# EAGLE design Main Board Smart Door (EAGLE 9.6.2)
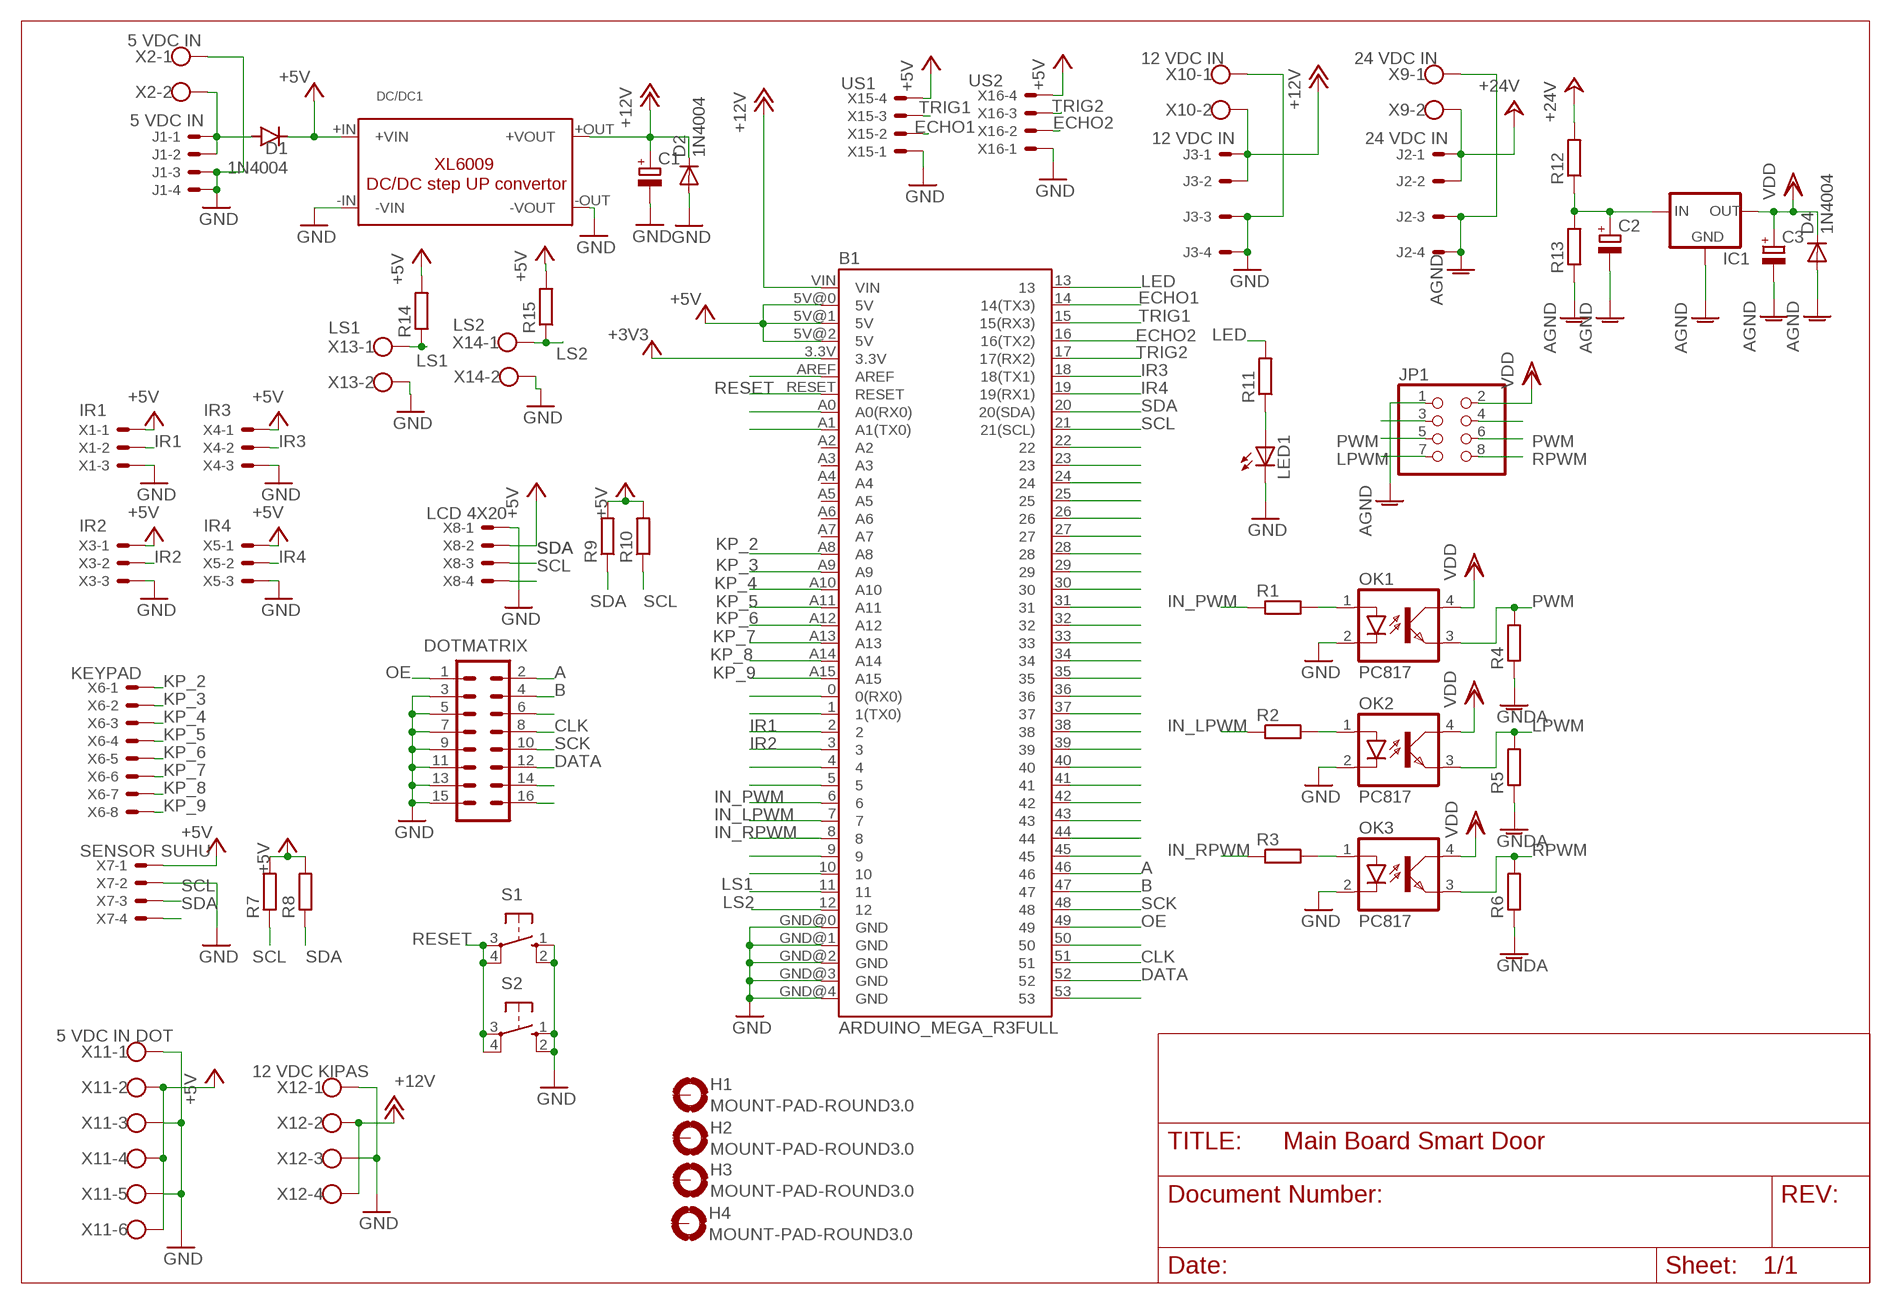
[diagram p0: schematic, sheet 1]

## Parts
B1  ARDUINO_MEGA_R3FULL  [ARDUINO_MEGA]
C1  C-POL_RADIAL-25MM-DIA  [CAPPRD550W110D1250H2500B]
C2  C-POL_RADIAL-25MM-DIA  [CAPPRD550W110D1250H2500B]
C3  C-POL_RADIAL-25MM-DIA  [CAPPRD550W110D1250H2500B]
D1  1N4004  [DO41-10]
D2  1N4004  [DO41-10]
D4  1N4004  [DO41-10]
DC/DC1  DC/DC-STEP-UP-XL6009  [DC/DC-STEP-UP-XL6009]
DOTMATRIX  ML16  [ML16]
H1  MOUNT-PAD-ROUND3.0  [3,0-PAD]
H2  MOUNT-PAD-ROUND3.0  [3,0-PAD]
H3  MOUNT-PAD-ROUND3.0  [3,0-PAD]
H4  MOUNT-PAD-ROUND3.0  [3,0-PAD]
IC1  78XXL  [78XXL]
J1  5 VDC IN  22-27-2041-04  [6410-04]
J2  24 VDC IN  22-27-2041-04  [6410-04]
J3  12 VDC IN  22-27-2041-04  [6410-04]
JP1  PINHD-2X4  [2X04]
LED1  LED5MM  [LED5MM]
OK1  PC817  [DIL04]
OK2  PC817  [DIL04]
OK3  PC817  [DIL04]
R1  R-EU_0207/10  [0207/10]
R2  R-EU_0207/10  [0207/10]
R3  R-EU_0207/10  [0207/10]
R4  R-EU_0207/10  [0207/10]
R5  R-EU_0207/10  [0207/10]
R6  R-EU_0207/10  [0207/10]
R7  R-EU_0207/10  [0207/10]
R8  R-EU_0207/10  [0207/10]
R9  R-EU_0207/10  [0207/10]
R10  R-EU_0207/10  [0207/10]
R11  R-EU_0207/10  [0207/10]
R12  R-EU_0207/10  [0207/10]
R13  R-EU_0207/10  [0207/10]
R14  R-EU_0207/10  [0207/10]
R15  R-EU_0207/10  [0207/10]
S1  40-XX  [B3F-40XX]
S2  10-XX  [B3F-10XX]
X1  IR1  JST-XH-03-PIN-LONG-PAD  [JST-XH-03-PACKAGE-LONG-PAD]
X2  5 VDC IN  W237-102  [W237-102]
X3  IR2  JST-XH-03-PIN-LONG-PAD  [JST-XH-03-PACKAGE-LONG-PAD]
X4  IR3  JST-XH-03-PIN-LONG-PAD  [JST-XH-03-PACKAGE-LONG-PAD]
X5  IR4  JST-XH-03-PIN-LONG-PAD  [JST-XH-03-PACKAGE-LONG-PAD]
X6  KEYPAD  JST-XH-08-PIN-LONG-PAD  [JST-XH-08-PACKAGE-LONG-PAD]
X7  SENSOR SUHU  JST-XH-04-PIN-LONG-PAD  [JST-XH-04-PACKAGE-LONG-PAD]
X8  LCD 4X20  JST-XH-04-PIN-LONG-PAD  [JST-XH-04-PACKAGE-LONG-PAD]
X9  24 VDC IN  W237-102  [W237-102]
X10  12 VDC IN  W237-102  [W237-102]
X11  5 VDC IN DOT  W237-6  [W237-6]
X12  12 VDC KIPAS  W237-4  [W237-4]
X13  LS1  W237-102  [W237-102]
X14  LS2  W237-102  [W237-102]
X15  US1  JST-XH-04-PIN-LONG-PAD  [JST-XH-04-PACKAGE-LONG-PAD]
X16  US2  JST-XH-04-PIN-LONG-PAD  [JST-XH-04-PACKAGE-LONG-PAD]

## Nets
+3V3: B1.3.3V
+5V: B1.5V@0(5V) B1.5V@1(5V) B1.5V@2(5V) D1.C DC/DC1.+IN(+VIN) R7.2 R8.2 R9.2 R10.2 R14.2 R15.2 X1.1 X3.1 X4.1 X5.1 X7.1 X8.2 X11.2 X11.4 X11.6 X15.4 X16.4
+12V: B1.VIN C1.1(+) D2.C DC/DC1.+OUT(+VOUT) J3.1 J3.2 X10.2 X12.2 X12.4
+24V: J2.1 J2.2 R12.2 X9.2
A: B1.46 DOTMATRIX.2
AGND: C2.2(-) C3.2(-) D4.A IC1.GND J2.3 J2.4 JP1.1 R13.1 X9.1
B: B1.47 DOTMATRIX.4
CLK: B1.51 DOTMATRIX.8
DATA: B1.52 DOTMATRIX.12
ECHO1: B1.14(14(TX3)) X15.2
ECHO2: B1.16(16(TX2)) X16.2
GND: B1.GND@0(GND) B1.GND@1(GND) B1.GND@2(GND) B1.GND@3(GND) B1.GND@4(GND) C1.2(-) D2.A DC/DC1.-IN(-VIN) DC/DC1.-OUT(-VOUT) DOTMATRIX.3 DOTMATRIX.5 DOTMATRIX.7 DOTMATRIX.9 DOTMATRIX.11 DOTMATRIX.13 DOTMATRIX.15 J1.3 J1.4 J3.3 J3.4 LED1.K(C) OK1.2(C) OK2.2(C) OK3.2(C) S1.1(S) S1.2(S1) S2.1(S) S2.2(S1) X1.3 X2.1 X3.3 X4.3 X5.3 X7.2 X8.1 X10.1 X11.1 X11.3 X11.5 X12.1 X12.3 X13.2 X14.2 X15.1 X16.1
GNDA: R4.1 R5.1 R6.1
IN_LPWM: B1.7 R2.1
IN_PWM: B1.6 R1.1
IN_RPWM: B1.8 R3.1
IR1: B1.2 X1.2
IR2: B1.3 X3.2
IR3: B1.18(18(TX1)) X4.2
IR4: B1.19(19(RX1)) X5.2
KP_2: B1.A8 X6.1
KP_3: B1.A9 X6.2
KP_4: B1.A10 X6.3
KP_5: B1.A11 X6.4
KP_6: B1.A12 X6.5
KP_7: B1.A13 X6.6
KP_8: B1.A14 X6.7
KP_9: B1.A15 X6.8
LED: B1.13 R11.2
LPWM: JP1.7 OK2.3(EMIT) R5.2
LS1: B1.11 R14.1 X13.1
LS2: B1.12 R15.1 X14.1
N$1: LED1.A R11.1
N$4: B1.AREF
N$5: D1.A J1.1 J1.2 X2.2
N$6: B1.A0(A0(RX0))
N$7: B1.A1(A1(TX0))
N$8: OK1.1(A) R1.2
N$10: JP1.3
N$12: OK2.1(A) R2.2
N$22: B1.0(0(RX0))
N$23: B1.1(1(TX0))
N$24: OK3.1(A) R3.2
N$26: B1.4
N$27: B1.5
N$31: B1.9
N$32: B1.10
N$34: JP1.4
N$43: B1.22
N$44: B1.23
N$45: B1.24
N$46: B1.25
N$47: B1.26
N$48: B1.27
N$49: B1.28
N$50: B1.29
N$51: B1.30
N$52: B1.31
N$53: B1.32
N$54: B1.33
N$55: B1.34
N$56: B1.35
N$57: B1.36
N$58: B1.37
N$59: B1.38
N$60: B1.39
N$61: B1.40
N$62: B1.41
N$63: B1.42
N$64: B1.43
N$65: B1.44
N$66: B1.45
N$71: B1.50
N$74: B1.53
N$83: DOTMATRIX.6
N$87: DOTMATRIX.14
N$88: DOTMATRIX.16
OE: B1.49 DOTMATRIX.1
PWM: JP1.5 JP1.6 OK1.3(EMIT) R4.2
RESET: B1.RESET S1.3(P) S1.4(P1) S2.3(P) S2.4(P1)
RPWM: JP1.8 OK3.3(EMIT) R6.2
SCK: B1.48 DOTMATRIX.10
SCL: B1.21(21(SCL)) R7.1 R10.1 X7.3 X8.4
SDA: B1.20(20(SDA)) R8.1 R9.1 X7.4 X8.3
TRIG1: B1.15(15(RX3)) X15.3
TRIG2: B1.17(17(RX2)) X16.3
VD1: C2.1(+) IC1.IN R12.1 R13.2
VDD: C3.1(+) D4.C IC1.OUT JP1.2 OK1.4(COL) OK2.4(COL) OK3.4(COL)
Unconnected: B1.A2 B1.A3 B1.A4 B1.A5 B1.A6 B1.A7 H1.B3,0(MOUNT) H2.B3,0(MOUNT) H3.B3,0(MOUNT) H4.B3,0(MOUNT)

## Library data of the parts
B1 = SparkFun-Boards:ARDUINO_MEGA_R3: Arduino Mega R3 ATmega2560 R3 compatible footprint. SparkFun Products: Arduino Mega 2560 R3 <https://www.sparkfun.com/products/11061>
C1-C3 = Capacitor:C-POL: Capacitor Polarised - Generic; CATEGORY: Capacitor
D1 = diode:1N4004: DIODE
D2 D4 = adafruit:1N4004: DIODE
DC/DC1 = hacesoft:DC/DC-STEP-UP-XL6009
DOTMATRIX = con-harting-ml:ML16: HARTING; OC_FARNELL: unknown; OC_NEWARK: unknown
H1-H4 = holes:MOUNT-PAD-ROUND: MOUNTING PAD, round
IC1 = v-reg-2:78XXL: VOLTAGE REGULATOR
J1-J3 = con-molex:22-?-04: CONNECTOR wire to board 2.54 mm (.1 inch) pitch header; MF: MOLEX; OC_FARNELL: unknown; OC_NEWARK: unknown
JP1 = pinhead:PINHD-2X4: PIN HEADER
LED1 = adafruit:LED: LED OSRAM: - CHIPLED LG R971, LG N971, LY N971, LG Q971, LY Q971, LO R971, LY R971 LH N974, LH R974 LS Q976, LO Q976, LY Q976 LO Q996 - Hyper CHIPLED LW Q18S LB Q993, LB Q99A, LB R99A - SideLED LS A670, LO A670, LY A670, LG A670, LP A670 LB A673, LV A673, LT A673, LW A673 LH A674 LY A675 LS A676, LA A676, LO A676, LY A676, LW A676 LS A679, LY A679, LG A679 - Hyper Micro SIDELED® LS Y876, LA Y876, LO Y876, LY Y876 LT Y87S - SmartLED LW L88C, LW L88S LB L89C, LB L89S, LG L890 LS L89K, LO L89K, LY L89K LS L896, LA L896, LO L896, LY L896 - TOPLED LS T670, LO T670, LY T670, LG T670, LP T670 LSG T670, LSP T670, LSY T670, LOP T670, LYG T670 LG T671, LOG T671, LSG T671 LB T673, LV T673, LT T673, LW T673 LH T674 LS T676, LA T676, LO T676, LY T676, LB T676, LH T676, LSB T676, LW T676 LB T67C, LV T67C, LT T67C, LS T67K, LO T67K, LY T67K, LW E67C LS E67B, LA E67B, LO E67B, LY E67B, LB E67C, LV E67C, LT E67C LW T67C LS T679, LY T679, LG T679 LS T770, LO T770, LY T770, LG T770, LP T770 LB T773, LV T773, LT T773, LW T773 LH T774 LS E675, LA E675, LY E675, LS T675 LS T776, LA T776, LO T776, LY T776, LB T776 LHGB T686 LT T68C, LB T68C - Hyper Mini TOPLED® LB M676 - Mini TOPLED Santana® LG M470 LS M47K, LO M47K, LY M47K Source: http://www.osram.convergy.de/
OK1-OK3 = optocoupler:PC817: SHARP OPTO COUPLER; MPN: PC817X4J000F; OC_FARNELL: 9707727; OC_NEWARK: 97K7059
R1-R15 = resistor:R-EU_: RESISTOR, European symbol
S1 = switch-omron:40-XX: OMRON SWITCH; MF: OMRON COMPONENTS USA; MPN: B3F-4000; OC_FARNELL: 176434; OC_NEWARK: 36K3105
S2 = switch-omron:10-XX: OMRON SWITCH; MPN: B3F-1000; OC_FARNELL: 176432; OC_NEWARK: 36M3542
X1 X3-X5 = Rembrandt Electronics - JST XH Connectors v1-0:JST-XH-03-PIN: JST XH Connector 2 Pin Wire to board connector. Pitch: 2,54 mm, (0.100") Number of pins: 3 Created by Rembrandt Electronics www.rembrandtelectronics.com
X2 X9 X10 X13 X14 = con-wago-500:W237-102: WAGO SCREW CLAMP; MPN: 237-102; OC_FARNELL: unknown; OC_NEWARK: 70K9898
X6 = Rembrandt Electronics - JST XH Connectors v1-0:JST-XH-08-PIN: JST XH Connector 2 Pin Wire to board connector. Pitch: 2,54 mm, (0.100") Number of pins: 8 Created by Rembrandt Electronics www.rembrandtelectronics.com
X7 X8 X15 X16 = Rembrandt Electronics - JST XH Connectors v1-0:JST-XH-04-PIN: JST XH Connector 2 Pin Wire to board connector. Pitch: 2,54 mm, (0.100") Number of pins: 4 Created by Rembrandt Electronics www.rembrandtelectronics.com
X11 = con-wago-500:W237-6: WAGO SCREW CLAMP; OC_FARNELL: unknown; OC_NEWARK: unknown
X12 = con-wago-500:W237-4: WAGO SCREW CLAMP; OC_FARNELL: unknown; OC_NEWARK: unknown

## Board
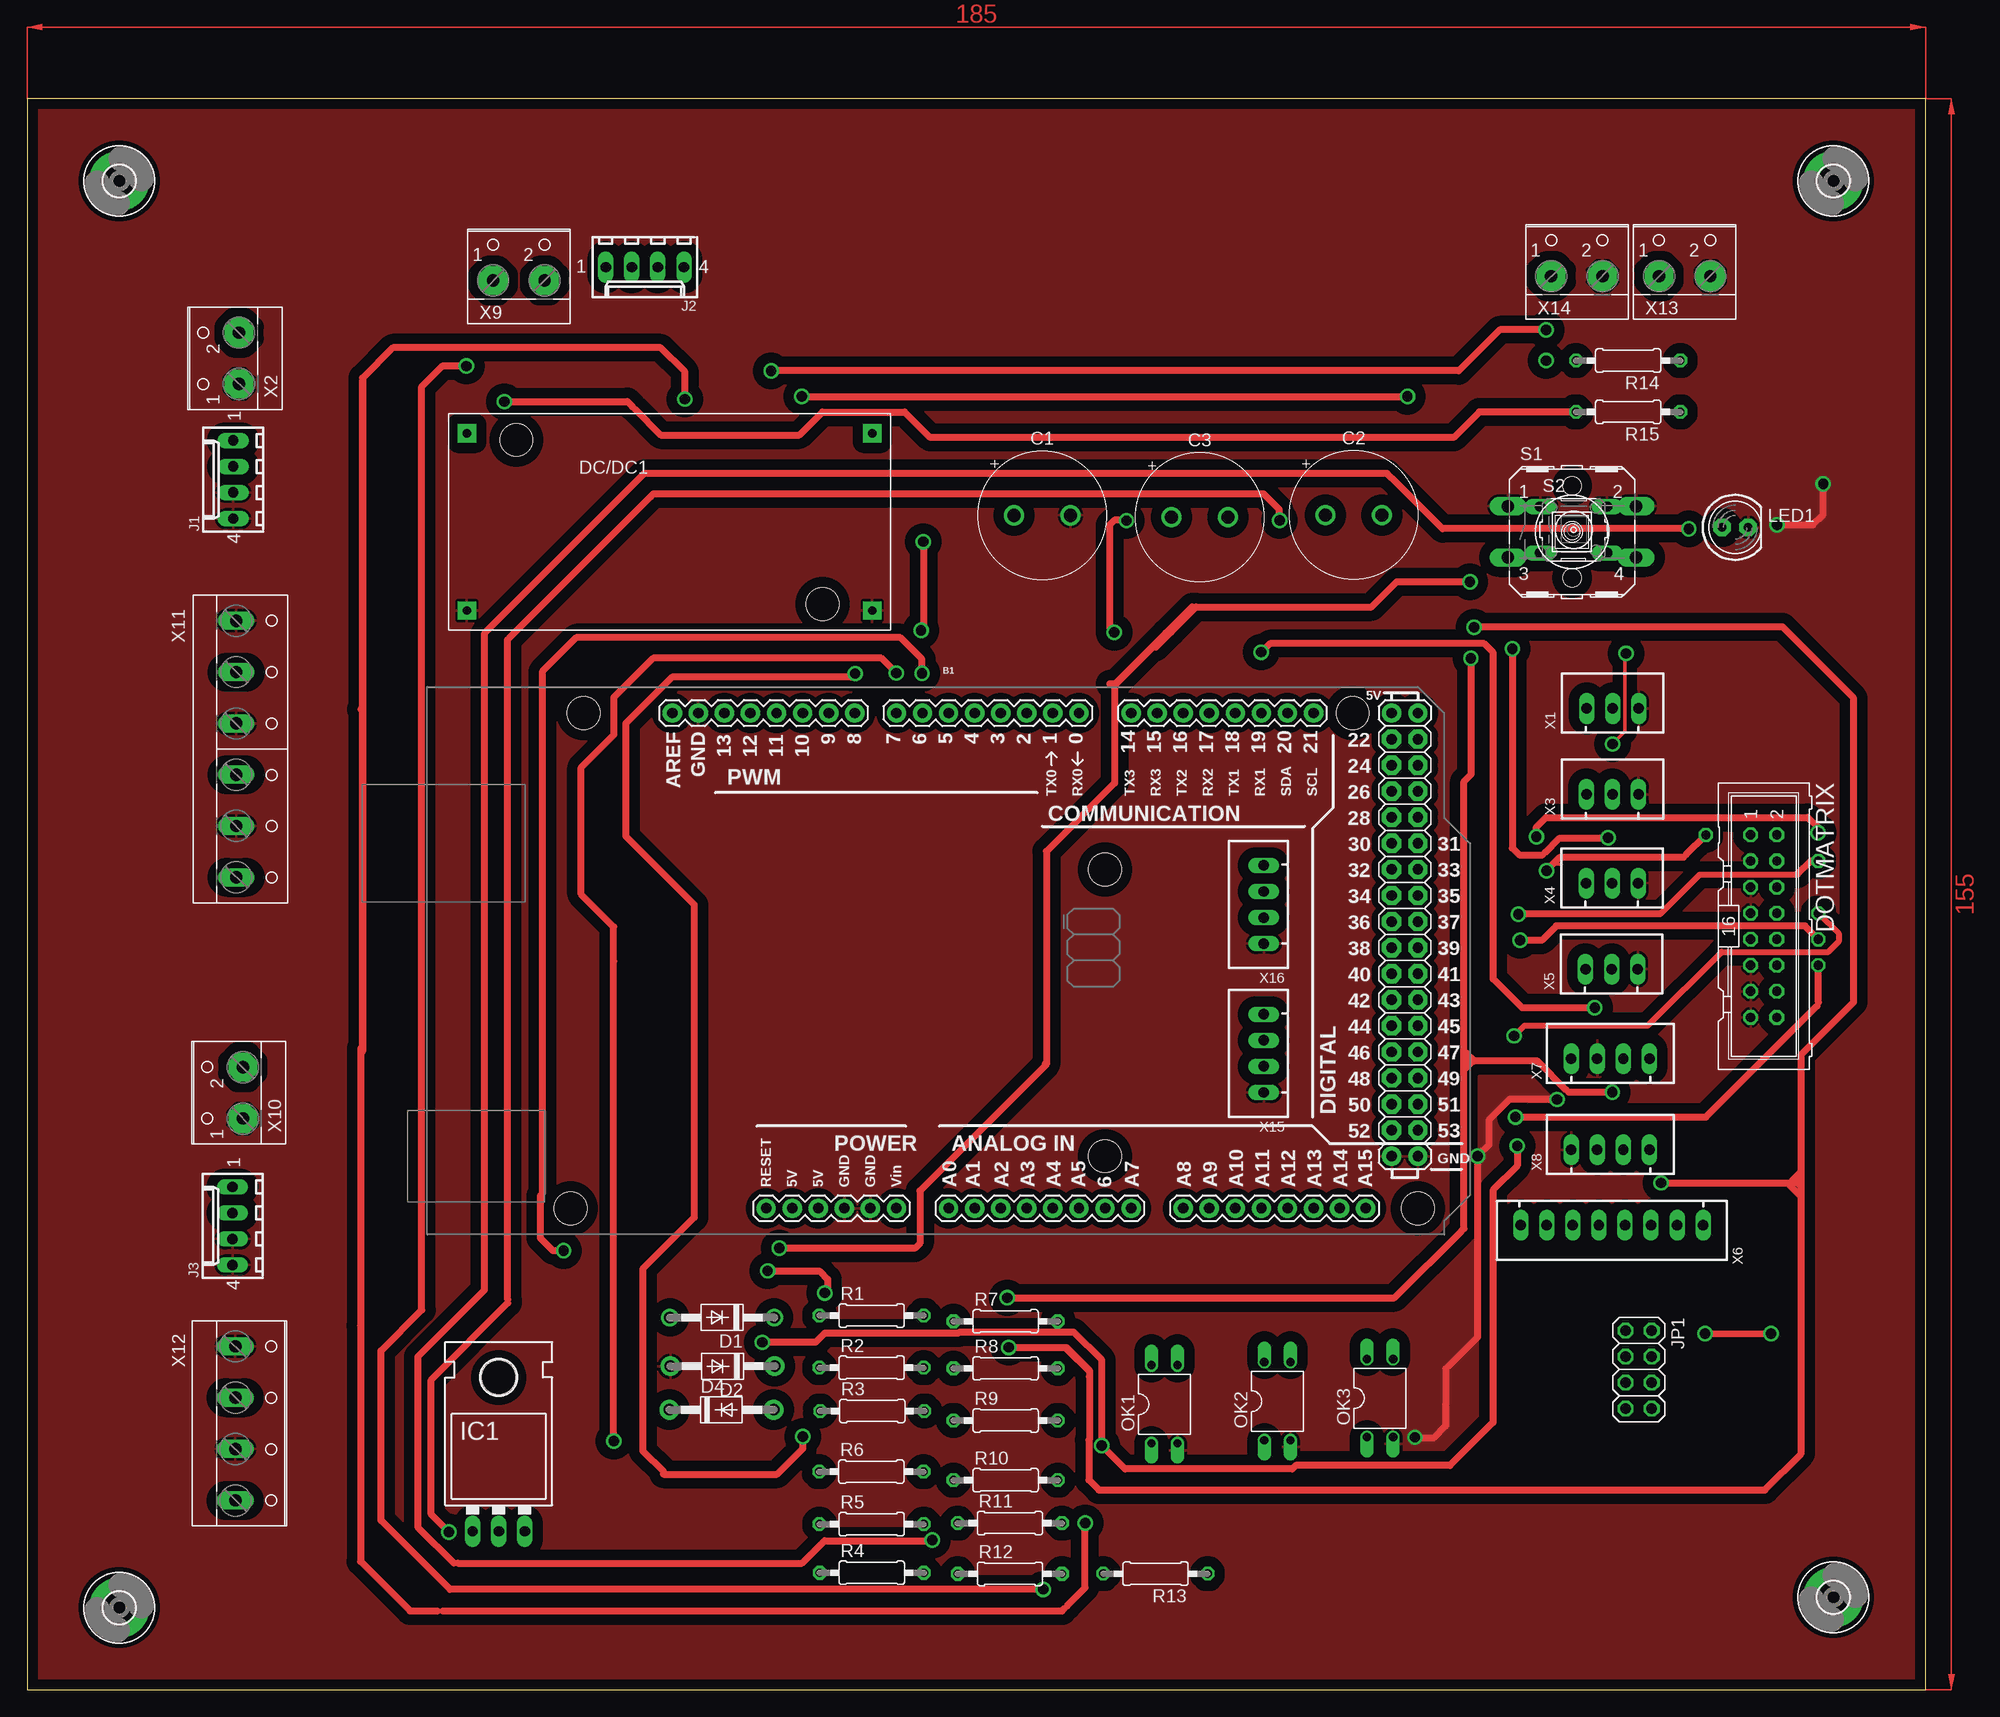
[diagram p1: board, top side]
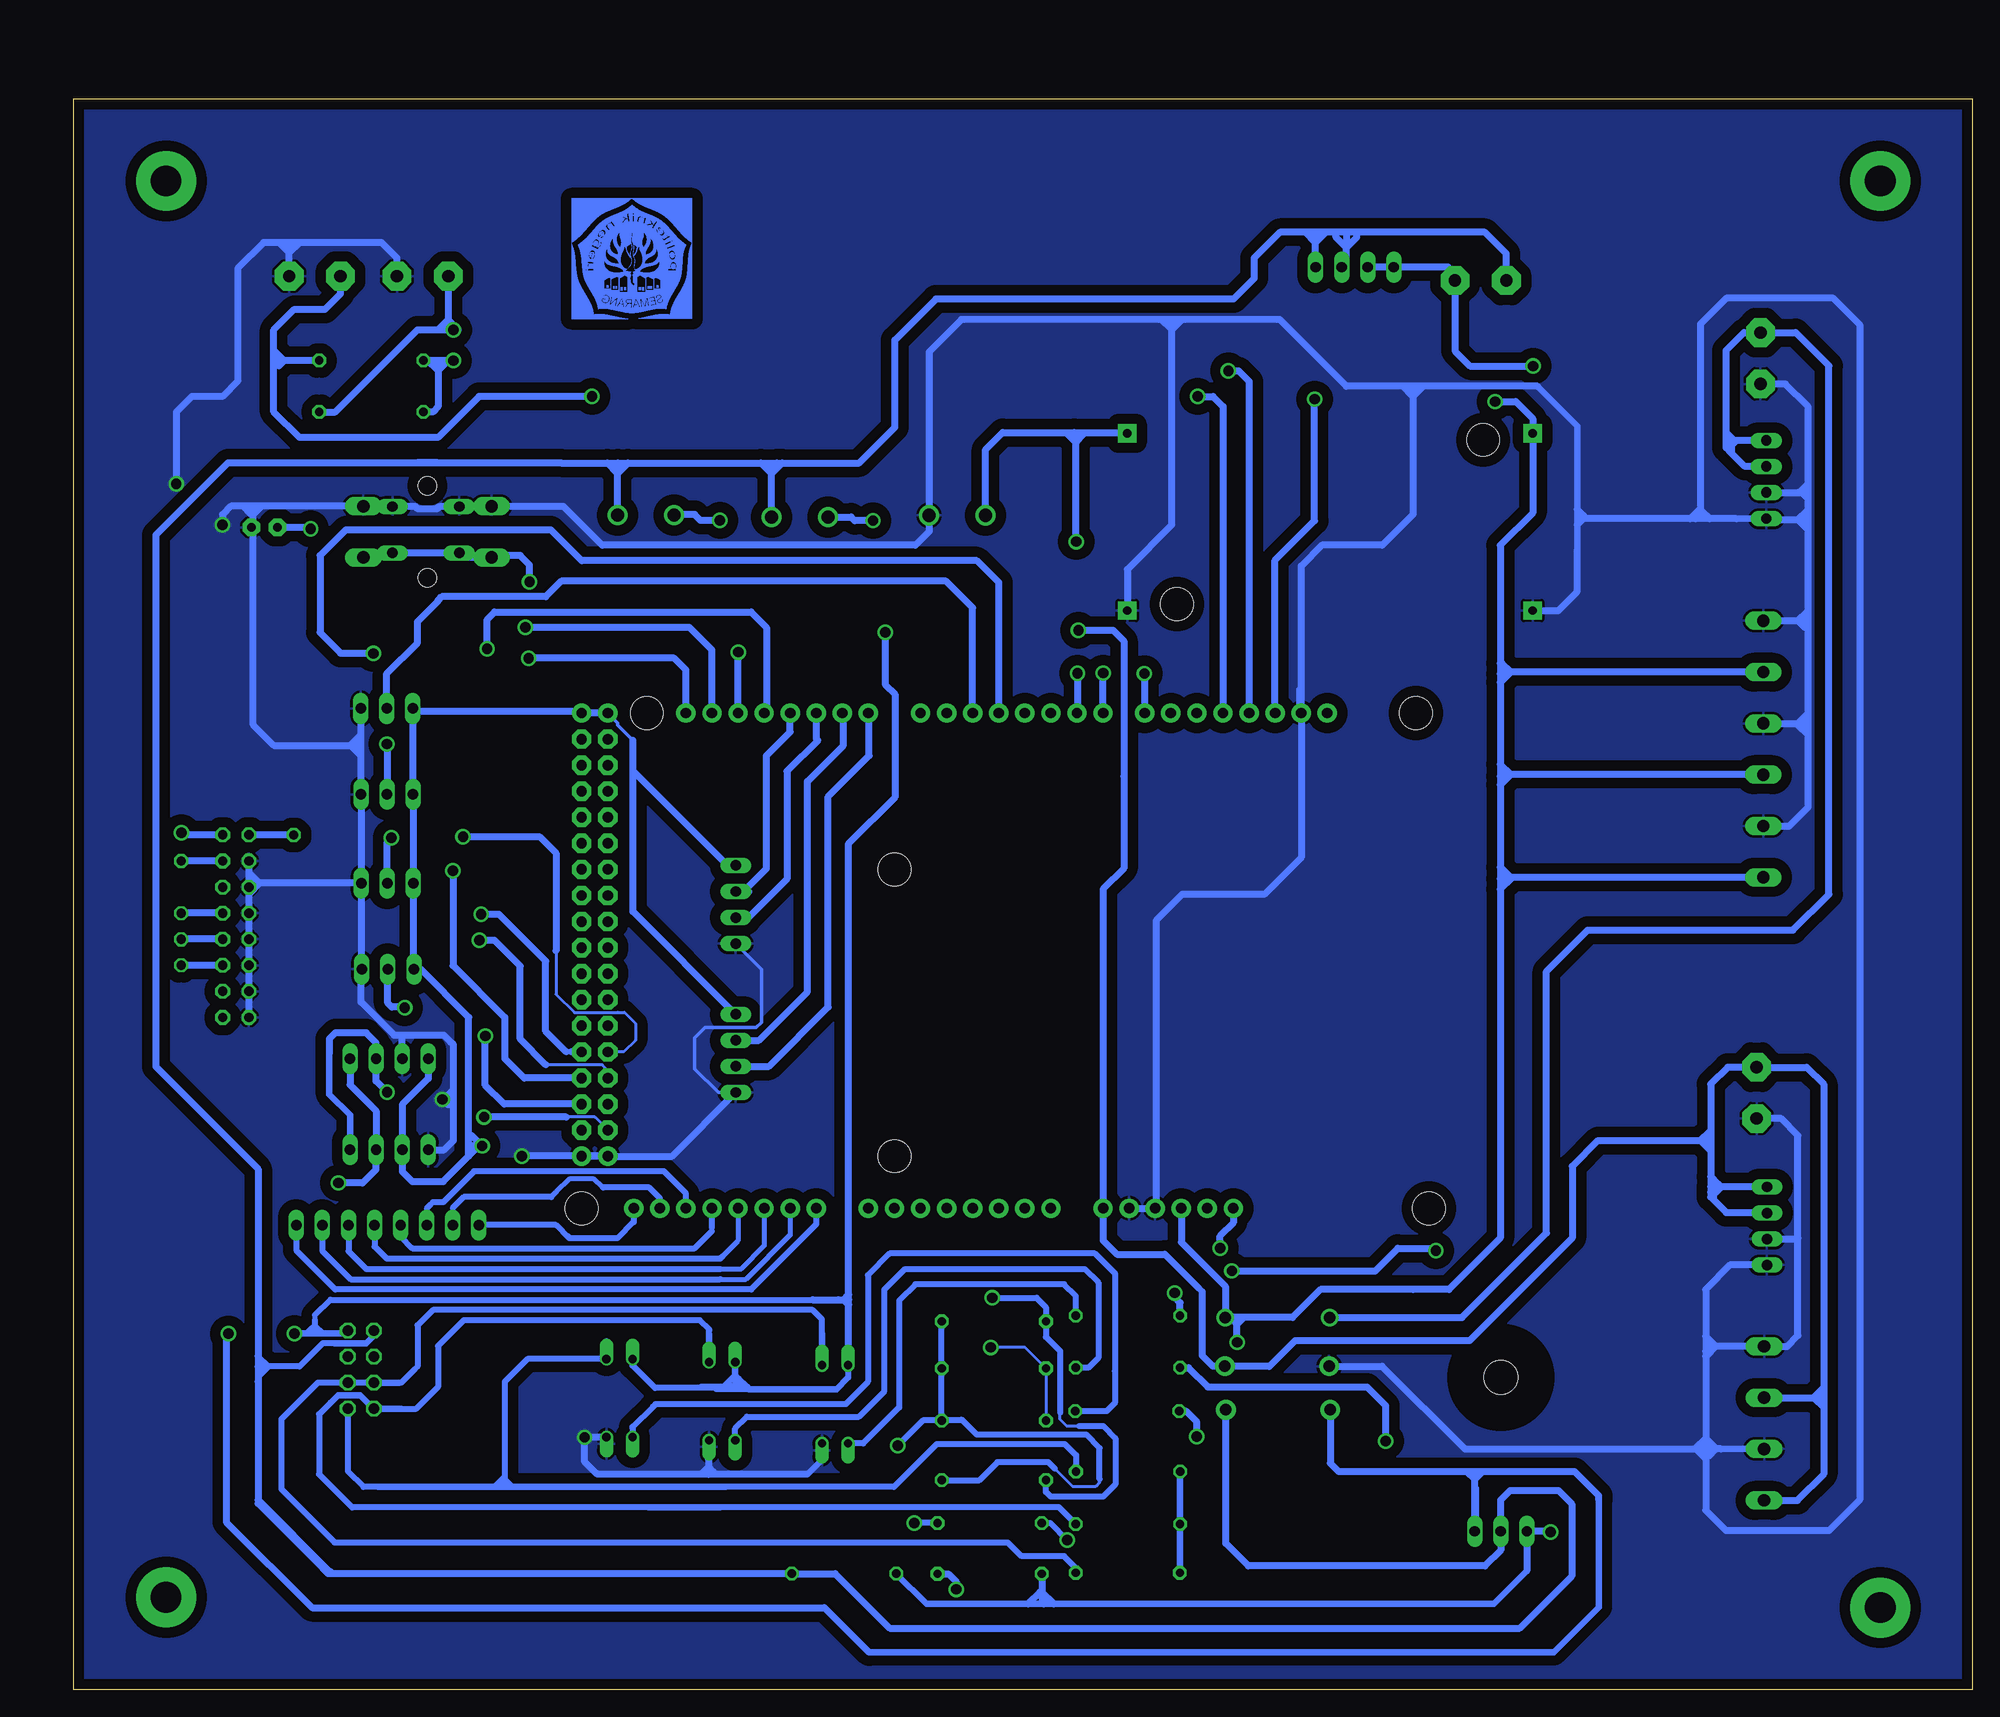
[diagram p2: board, bottom side, seen from below]

Size 185 x 155 mm. Coordinates in mm from the lower left corner, seen from the top.
Outline: 0,0 185,0 185,155 0,155 0,0
Copper layers (1*16): Top 0.035mm / dielectric 1.5mm / Bottom 0.035mm
Design rules "default": minimum track width 6mil, minimum drill 0.35mm, track to track 6mil, track to pad 6mil, pad to pad 6mil, via to via 6mil, smd to smd 6mil, copper to edge 40mil, drill to drill 6mil, minimum pad ring 10mil, minimum via ring 8mil, stop-mask expansion 4mil, vias tented up to drill 0mil, thermal gap 10mil

### Footprints (pad centres in the part's own frame; a part is rotated, then mirrored left to right if it is on the bottom)
ARDUINO_MEGA = drill 1.016 pad 1.88: 0 13.97,24.13; 1 11.43,24.13; 2 8.89,24.13; 3 6.35,24.13; 3.3V -13.97,-24.13; 4 3.81,24.13; 5 1.27,24.13; 5V@0 -11.43,-24.13; 5V@1 44.45,24.13; 5V@2 46.99,24.13; 6 -1.27,24.13; 7 -3.81,24.13; 8 -7.874,24.13; 9 -10.414,24.13; 10 -12.954,24.13; 11 -15.494,24.13; 12 -18.034,24.13; 13 -20.574,24.13; 14 19.05,24.13; 15 21.59,24.13; 16 24.13,24.13; 17 26.67,24.13; 18 29.21,24.13; 19 31.75,24.13; 20 34.29,24.13; 21 36.83,24.13; A0 1.27,-24.13; A1 3.81,-24.13; A2 6.35,-24.13; A3 8.89,-24.13; A4 11.43,-24.13; A5 13.97,-24.13; A6 16.51,-24.13; A7 19.05,-24.13; A8 24.13,-24.13; A9 26.67,-24.13; A10 29.21,-24.13; A11 31.75,-24.13; A12 34.29,-24.13; A13 36.83,-24.13; A14 39.37,-24.13; A15 41.91,-24.13; AREF -25.654,24.13; GND@0 -8.89,-24.13; GND@1 -6.35,-24.13; GND@2 44.45,-19.05; GND@3 46.99,-19.05; GND@4 -23.114,24.13; RESET -16.51,-24.13; VIN -3.81,-24.13 | drill 1.016 pad 1.88 octagon: 22 44.45,21.59; 23 46.99,21.59; 24 44.45,19.05; 25 46.99,19.05; 26 44.45,16.51; 27 46.99,16.51; 28 44.45,13.97; 29 46.99,13.97; 30 44.45,11.43; 31 46.99,11.43; 32 44.45,8.89; 33 46.99,8.89; 34 44.45,6.35; 35 46.99,6.35; 36 44.45,3.81; 37 46.99,3.81; 38 44.45,1.27; 39 46.99,1.27; 40 44.45,-1.27; 41 46.99,-1.27; 42 44.45,-3.81; 43 46.99,-3.81; 44 44.45,-6.35; 45 46.99,-6.35; 46 44.45,-8.89; 47 46.99,-8.89; 48 44.45,-11.43; 49 46.99,-11.43; 50 44.45,-13.97; 51 46.99,-13.97; 52 44.45,-16.51; 53 46.99,-16.51 | hole 3.2: -34.29,24.13; -35.56,-24.13; 16.51,8.89; 16.51,-19.05; 40.64,24.13; 46.99,-24.13
CAPPRD550W110D1250H2500B = drill 1.3 pad 1.95: 1 -2.75,0; 2 2.75,0
DO41-10 = drill 1.118: A 5.08,0; C -5.08,0
DO41-10' = drill 1.118 pad 1.93: A 5.08,0; C -5.08,0
DC/DC-STEP-UP-XL6009 = drill 0.8 pad 1.778 square: +IN 1.778,19.177; +OUT 41.275,19.177; -IN 1.778,1.905; -OUT 41.275,1.905 | hole 3.2: 6.604,18.542; 36.449,2.54
ML16 = drill 0.914 octagon: 1 -8.89,-1.27; 2 -8.89,1.27; 3 -6.35,-1.27; 4 -6.35,1.27; 5 -3.81,-1.27; 6 -3.81,1.27; 7 -1.27,-1.27; 8 -1.27,1.27; 9 1.27,-1.27; 10 1.27,1.27; 11 3.81,-1.27; 12 3.81,1.27; 13 6.35,-1.27; 14 6.35,1.27; 15 8.89,-1.27; 16 8.89,1.27
3,0-PAD = drill 3 pad 5.842: B3,0 0,0
78XXL = drill 1.016 long: GND 0,-3.81; IN -2.54,-3.81; OUT 2.54,-3.81 | hole 3.302: 0,11.176
6410-04 = drill 1.016 long: 1 3.81,0; 2 1.27,0; 3 -1.27,0; 4 -3.81,0
2X04 = drill 1.016 octagon: 1 -3.81,-1.27; 2 -3.81,1.27; 3 -1.27,-1.27; 4 -1.27,1.27; 5 1.27,-1.27; 6 1.27,1.27; 7 3.81,-1.27; 8 3.81,1.27
LED5MM = drill 0.813 pad 1.676 octagon: A -1.27,0; K 1.27,0
DIL04 = drill 0.813 offset: 1 -1.27,-3.81; 2 1.27,-3.81; 3 1.27,3.81; 4 -1.27,3.81
0207/10 = drill 0.813 octagon: 1 -5.08,0; 2 5.08,0
B3F-40XX = drill 1.194 long: 1 -6.248,2.489; 2 6.248,2.489; 3 -6.248,-2.489; 4 6.248,-2.489 | hole 1.803: 0,-4.496; 0,4.496
B3F-10XX = drill 1.016 long: 1 -3.251,2.261; 2 3.251,2.261; 3 -3.251,-2.261; 4 3.251,-2.261
JST-XH-03-PACKAGE-LONG-PAD = drill 1.016 long: 1 -2.54,0; 2 0,0; 3 2.54,0
W237-102 = drill 1.194 pad 2.794 octagon: 1 -2.5,-1.27; 2 2.5,-1.27
JST-XH-08-PACKAGE-LONG-PAD = drill 1.016 long: 1 -8.89,0; 2 -6.35,0; 3 -3.81,0; 4 -1.27,0; 5 1.27,0; 6 3.81,0; 7 6.35,0; 8 8.89,0
JST-XH-04-PACKAGE-LONG-PAD = drill 1.016 long: 1 -3.81,0; 2 -1.27,0; 3 1.27,0; 4 3.81,0
W237-6 = drill 1.194 long: 1 -12.5,-1.27; 2 -7.5,-1.27; 3 -2.5,-1.27; 4 2.5,-1.27; 5 7.5,-1.27; 6 12.5,-1.27
W237-4 = drill 1.194 long: 1 -7.5,-1.27; 2 -2.5,-1.27; 3 2.5,-1.27; 4 7.5,-1.27

### Placement (x,y rotation side)
B1  88.52,71.03 0 top
C1  98.91,114.42 0 top
C2  129.26,114.45 0 top
C3  114.26,114.25 0 top
D1  67.72,36.26 180 top
D2  1N4004  [DO41-10']  67.76,31.52 180 top
D4  1N4004  [DO41-10']  67.66,27.28 0 top
DC/DC1  41.07,103.23 0 top
DOTMATRIX  169.21,74.39 270 top
H1  9,8 0 top
H2  176,9 0 top
H3  176,147 0 top
H4  9,147 0 top
IC1  45.96,19.24 0 top
J1  20.09,117.91 90 top
J2  60.19,138.6 180 top
J3  20.03,45.18 90 top
JP1  157.03,31.19 270 top
LED1  166.42,113.25 0 top
OK1  110.82,27.81 0 top
OK2  121.82,28.11 0 top
OK3  131.82,28.41 0 top
R1  82.29,36.45 0 top
R2  82.29,31.37 0 top
R3  82.35,27.15 0 top
R4  82.3,11.39 0 top
R5  82.29,16.13 0 top
R6  82.26,21.24 0 top
R7  95.35,35.89 0 top
R8  95.35,31.31 0 top
R9  95.35,26.23 0 top
R10  95.35,20.41 0 top
R11  95.76,16.23 0 top
R12  95.76,11.29 0 top
R13  109.95,11.3 180 top
R14  156,129.5 180 top
R15  156,124.5 180 top
S1  150.53,112.81 0 top
S2  150.69,113.01 0 top
X1  154.49,95.6 0 top
X2  19.39,129.72 90 top
X3  154.47,87.23 0 top
X4  154.44,78.58 0 top
X5  154.39,70.2 0 top
X6  154.42,45.27 180 top
X7  154.26,61.49 0 top
X8  154.26,52.6 0 top
X9  47.92,138.57 0 top
X10  19.76,58.15 90 top
X11  21.65,91.65 270 top
X12  21.57,25.95 270 top
X13  161.5,139 0 top
X14  151,139 0 top
X15  120.5,62 90 top
X16  120.5,76.5 90 top

### Tracks (layer width: path | path; a pad name or v marks a point on that pad's centre or on a via)
+5V  (via drill 1)
  Top 0.603: 59,125 59.25,124.75
  Top 0.7: R15.2 141.5,124.5 139,122 88,122 85.5,124.5 77.5,124.5 75.25,122.25 61.75,122.25 59.25,124.75 | v46.5,125.5 58.5,125.5 59,125 | v145.2,52.98 145.2,51.05 142.82,48.68 142.82,26.03 138.65,21.85 123.61,21.85 123.27,21.52 106.98,21.52 v104.71,23.78 104.71,32.12 101.99,34.83 90.86,34.83 90.75,34.73 77.73,34.73 76.85,33.85 v71.65,33.85
  Bottom 0.305: R7.2 100.43,31.5 R8.2 R9.2 100.5,26.23 101,26.23 102.27,26.23 | 85.04,20.5 85.04,20.2 85.41,19.84 87.71,19.84 89.44,21.56
  Bottom 0.35: B1.5V@1 132,94.19 132,94 130.5,92.5
  Bottom 0.6: R10.2 96.76,20.41 95,22.17 90.04,22.17 89.44,21.56 | 85.04,20.5 85.04,23.54 86.34,24.84 97,24.84 98.39,26.23 | 98.39,26.23 98.5,26.34 | 100.73,26.5 101,26.23 | 98.39,26.23 100.5,26.23 | v104.71,23.78 102.27,26.23 R9.2 100.43,31.5 | R8.2 R7.2
  Bottom 0.603: 45.94,125.5 v46.5,125.5
  Bottom 0.61: X11.2 21.79,99.15 | X8.2 152.99,53.62 | 150.41,61.45 X7.1 | X4.1 151.9,86.93 151.9,87.2 X3.1 | 151.68,95.32 X1.1 | 54.17,38.99 54.5,38.99
  Bottom 0.7: v46.5,125.5 44.5,125.5 42.85,123.85 DC/DC1.+IN 42.85,114.65 46,111.5 46,100 | 46,100 46,99 | 46,99 46,98.15 | 46,98.15 46,90.15 | 46,90.15 46,89 | 46,89 46,88.15 | 46,88.15 46,80.15 | 46,80.15 46,79 | 46,79 46,78 | 46,78 46,44 51.01,38.99 54.5,38.99 63.51,38.99 66.24,36.26 71,36.26 | X11.2 45,99.15 | 45,99.15 45.85,99.15 46,99 | X11.4 45,89.15 | 45,89.15 45.85,89.15 46,89 | X11.6 45,79.15 | 45,79.15 45.85,79.15 46,79 | 45,99.15 45.85,100 46,100 | 45,99.15 46,98.15 | 45,89.15 46,90.15 | 45,89.15 46,88.15 | 45,79.15 46,80.15 | 45,79.15 45,79 46,78 | 71,36.26 72,36.26 | 72,36.26 D1.C 72.8,39.3 77.09,43.59 B1.5V@0 | v71.65,33.85 71.65,35.61 | 71,36.26 71.65,35.61 | 71.65,35.61 72,35.97 72,36.26 | 149.5,129.5 v148,129.5 148.5,129.5 149.5,128.5 | 149.5,129.5 150.5,129.5 | 150.5,129.5 R14.2 | 149.5,129.5 149.5,128.5 | 149.5,128.5 149.5,125 150,124.5 R15.2 | 149.5,128.5 150.5,129.5 | X7.1 150.45,59.55 152.99,57.01 X8.2 152.99,50.49 152,49.5 149,49.5 146.5,52 | 146.5,52 146.5,53 | 146.5,53 146.5,54 | 146.5,54 146.5,65.5 151.2,70.2 X5.1 151.9,70.25 X4.1 151.93,78.6 X3.1 | v145.2,52.98 145.22,53 146.5,53 | v145.2,52.98 146.22,54 146.5,54 | v145.2,52.98 145.52,52.98 146.5,52 | B1.5V@1 B1.5V@2 135.67,95.32 151.68,95.32 | X1.1 151.95,86.98 151.9,86.93 | 130.5,89.5 130.5,92.5 | X16.4 121.31,80.31 130.5,89.5 | X15.4 130.5,75.81 130.5,89.5
+12V  (via drill 1)
  Top 0.7: v87.33,111.85 87.33,103.44 v87.11,103.22
  Bottom 0.305: 84.71,65 B1.VIN | 82.56,89 82.69,88.87 82.69,89
  Bottom 0.603: 87.77,111.85 v87.33,111.85
  Bottom 0.61: 20.38,61.3 X10.2 | X12.2 19.74,28.45 | 19.69,18.45 X12.4 | 75.03,38.77 75.38,39.12 | 84.71,43.76 84.71,46.5 B1.VIN
  Bottom 0.7: 25.5,54.5 25.5,59 23.85,60.65 X10.2 16.15,60.65 14.5,59 14.5,29.45 | 25.5,54.5 25.5,53.5 | 25.5,53.5 25.5,52.5 | 25.5,52.5 25.5,50 | 25.5,50 25.5,49 | 25.5,49 25.5,48.5 | 25.25,47.75 25.5,48 25.5,48.5 | 25.25,47.75 24,46.5 22.4,46.5 20.08,46.5 J3.2 | J3.1 24.49,48.99 | 24.49,48.99 25.49,48.99 25.5,49 | 24.49,48.99 24.75,49.25 | 24.75,49.25 25.5,50 | 24.75,49.25 25.5,48.5 | 25.5,53.5 26.5,53.5 | 26.5,53.5 36.5,53.5 39,51 39,44 49,34 66,34 68.5,31.5 72.82,31.5 D2.C 74.02,31.52 75.03,32.53 75.03,38.77 | 24.49,48.99 25.25,48.23 25.25,47.75 | 26.5,53.5 25.5,52.5 | 26.5,53.5 25.5,54.5 | X12.4 17.05,18.45 14.5,21 14.5,27.5 | 14.5,29.45 14.5,28.5 | 14.5,28.5 14.5,27.5 | X12.2 15.5,28.45 | 15.45,28.45 14.55,28.45 14.5,28.5 | 15.5,28.45 14.5,29.45 | 15.5,28.45 15.45,28.45 | 15.45,28.45 14.5,27.5 | DC/DC1.+OUT 82.5,122.41 | 82.5,122.41 86.5,122.41 | 86.5,122.41 88.17,122.41 88.17,122.34 87.33,121.5 | C1.1 96.16,120.84 94.5,122.5 87.5,122.5 | 87.5,122.5 82.59,122.5 82.5,122.41 | v87.33,111.85 87.33,121.5 | 87.33,121.57 87.33,122.33 87.5,122.5 | 87.33,121.57 87.33,121.5 | 87.33,121.57 86.5,122.41 | v87.11,103.22 83.72,103.22 82.69,102.19 82.69,89 82.69,80.02 84.71,78 84.71,65 84.71,46.5 | B1.VIN 84.71,43.76 83.38,42.43 78.69,42.43 75.38,39.12
+24V  (via drill 1)
  Top 0.7: v99.01,9.78 41.22,9.78 34.49,16.5 34.49,33.02 38.47,37 38.47,126.97 40.5,129 42.77,129 v42.8,128.97
  Bottom 0.305: X9.2 50.42,136.59 | 100.52,11.29 R12.2
  Bottom 0.7: J2.2 J2.1 51.1,138.6 50.42,137.92 X9.2 50.42,130.42 48.97,128.97 v42.8,128.97 | R12.2 99.79,11.29 99,10.5 v99,9.79 v99.01,9.78
A  (via drill 1)
  Top 0.7: v147.07,83.12 147.07,84.07 148,85 173.5,85 174.5,84 v174.5,83.5
  Bottom 0.305: B1.46 131.42,62.14 130.28,63.28 130.28,64.93 131.34,66 131.98,66 132.02,65.96 136.21,65.96 138,67.75 138,71.99
  Bottom 0.7: v147.07,83.12 139.62,83.12 138,81.5 138,71.99 | DOTMATRIX.2 174.28,83.28 v174.5,83.5
AGND
  Bottom 0.6: 159.59,33.77 160.73,33.77 163,31.5 166,31.5 | 166,31.5 166.5,31.5 | 166.5,31.5 167.04,31.5 | 166,31.5 167,32.5 167.04,32.5 | 166.5,31.5 167.04,30.96 167.04,30.46 | 166,31.5 167.04,30.46 | 167.04,30.46 167.04,30
  Bottom 0.61: JP1.1 155.76,34.5 156.49,33.77 159.59,33.77 | 160.71,11.8 167.04,18.13 | 169.25,119.53 169,119.53 137.5,119.53 137.09,119.53
  Bottom 0.7: D4.A 72.74,14.24 70.55,12.05 47.5,12.05 45.96,13.59 IC1.GND 45.96,18.48 45.03,19.4 40.35,19.4 39.05,18.11 39.05,11.06 44.12,5.99 105.49,5.99 110.8,11.3 R13.1 160.21,11.3 160.71,11.8 | 133,119.53 137.5,119.53 149.54,119.53 149.59,119.57 151.47,119.57 151.51,119.53 169,119.53 169.97,119.53 177,112.5 177,60.7 167.04,50.74 167.04,32.5 167.04,31.5 167.04,30 167.04,18.5 | 133,119.53 132,119.53 | 132,119.53 131,119.53 | 131,119.53 118.04,119.53 | 118.04,119.53 116.5,119.53 | 116.5,119.53 115.98,119.53 | 115.98,119.53 108.47,119.53 105,123 105,131.5 101,135.5 72,135.5 70,137.5 70,139.5 67.5,142 65,142 | X9.1 45.42,139.92 47.5,142 60,142 | 60,142 61,142 | 61,142 62,142 | 62,142 63,142 | 63,142 64,142 | 64,142 65,142 | J2.4 64,141 | 64,141 64,142 | J2.3 61,139.06 61,140.5 | 61,142 61,140.5 | 61,140.5 60,141.5 60,142 | 61,140.5 62,141.5 62,142 | 64,141 63,142 | 64,141 65,142 | C3.2 117.01,118.5 | 117.01,118.5 117.01,119.02 116.5,119.53 | 117.01,118.5 118.04,119.53 | 117.01,118.5 115.98,119.53 | C2.2 132,118.5 | 132,119.53 132,118.5 | 132,118.5 131,119.5 131,119.53 | 132,118.5 133,119.5 133,119.53 | 167.04,18.5 167.04,18.13 | 167.04,18.5 160.04,11.5 160,11.5
B  (via drill 0.9 pad 1.35, 1)
  Top 0.6: 172.5,79.46 172.44,79.4 162.94,79.4 159.18,75.64
  Top 0.7: v145.3,75.55 145.39,75.64 159.18,75.64 | v174.53,80.73 173.77,80.73 172.5,79.46
  Bottom 0.305: 136.5,62.14 137,62.14
  Bottom 0.61: 174.6,80.73 v174.53,80.73
  Bottom 0.7: DOTMATRIX.4 174.59,80.74 174.6,80.73 | B1.47 136.5,62.14 | 137,62.14 139,64.14 139,71 143.55,75.55 v145.3,75.55
CLK  (via drill 0.9 pad 1.35, 1)
  Top 0.6: v174.53,75.65 176.5,73.69 176.5,72.9 175.5,71.9 165.1,71.9 157.9,64.7 145.89,64.7 v144.89,63.7
  Bottom 0.61: 174.62,75.65 v174.53,75.65
  Bottom 0.7: DOTMATRIX.8 174.62,75.66 174.62,75.65 | B1.51 143.06,57.06 144.89,58.89 v144.89,63.7
DATA  (via drill 0.9 pad 1.35, 1)
  Top 0.305: 174.39,66.61 174.54,66.75 174.54,67 | v145.02,55.8 145.01,55.81
  Top 0.7: 174.39,66.61 163.59,55.8 v145.02,55.8 | 174.54,67 174.53,67 v174.53,70.58
  Bottom 0.305: 137,55.8 134.21,55.8 132.97,54.56 B1.52
  Bottom 0.61: 174.58,70.58 174.59,70.58 v174.53,70.58
  Bottom 0.7: DOTMATRIX.12 174.58,70.58 | 137,55.8 v145.02,55.8
ECHO1
  Bottom 0.7: X15.2 117.27,60.73 111.5,66.5 111.5,87 107.5,91 107.5,95.09 B1.14
ECHO2
  Bottom 0.7: X16.2 119.27,75.23 115.5,79 115.5,89.5 112.5,92.5 112.65,92.65 B1.16
GND  (via drill 1)
  Top 0.305: 141.42,52.08 v141.33,51.99 | 138.49,31.51 138.24,31.26
  Top 0.7: v170.5,113.5 174,113.5 175,114.5 v175,117.5 | v149.07,57.52 144.45,57.52 142.43,55.5 142.43,53.1 141.42,52.08 | v141.33,51.99 141.33,34.35 138.49,31.51 | 138.24,31.26 138.24,27.84 138.2,27.8 138.2,25.7 137,24.5 135.3,24.5 v135.22,24.59
  Bottom 0.305: 135.2,24.6 v135.22,24.59 | 156.93,68.47 156.93,70 X5.3 | B1.GND@4 65.58,95.33 | 149.06,57.5 149.07,57.5 v149.07,57.52
  Bottom 0.35: X16.1 118,70.19 118,65 118.5,64.5 123.5,64.5 124.5,63.5 124.5,60.5 122.19,58.19 X15.1
  Bottom 0.6: OK1.2 112.09,22.41 113.5,21 | 134,21.09 134,21 | 166.86,78.58 167.79,79.5 167.94,79.5
  Bottom 0.61: 19.51,127.22 X2.1 | 20.38,113.81 J1.4 23,114.1 | 20.38,103.81 X11.1 | 19.93,94.15 X11.3 | 19.6,43.91 J3.3 | J3.4 20.03,41.65 20.3,41.38 | 26,23.45 25,23.45 24.5,23.45 X12.3 | S2.1 149.42,115.27 149.61,115.08 151.45,115.08 151.64,115.27 S2.2 154.5,115.27 156.75,115.27 S1.2 | 123.15,22.45 123.15,24.24 OK2.2 | 148.16,63 148.33,63.17 | 167.94,71 DOTMATRIX.11 | 157.01,79.04 157.01,87 X3.3 157.03,87.25 157.03,90.5 157.03,92 157.03,92.5 157.03,93 X1.3 | 157.01,79.04 157.01,78.3 157.29,78.03 157.29,78.27 X4.3 | X5.3 156.93,78.96 157.01,79.04 | B1.GND@2 B1.GND@3 135.95,51.53 135.95,51.54 B1.GND@3 | 42.3,126.93 38.51,123.14 38.51,115 38.51,113.5 38.51,111 38.51,109.48 | 65.58,97.46 65.58,95.33 | B1.GND@1 82.4,46.9 82.65,46.64 82.42,46.64 B1.GND@1
  Bottom 0.7: X11.5 17.85,84.15 16,86 16,93 | 16,93 16,94.5 | 16,94.5 16,95.15 | 16,95.15 16,103.5 | 16,103.5 16,104.5 | 16,104.5 16,105.15 | 16,105.15 16,113 | 16,113 16,114 | 16,114 16,115 | 16,115 16,116 | 16,116 16,117 | 16,117 16,117.5 | 16,117.5 16,125 18.22,127.22 X2.1 | J1.3 16.86,116.64 | 16.86,116.64 16.36,116.64 16,117 | J1.4 19.99,114 17,114 | 16,114 17,114 | X11.1 17,104.15 | 17,104.15 16.35,104.15 16,104.5 | X11.3 17,94.15 | 17,94.15 16.35,94.15 16,94.5 | 16.86,116.64 16,117.5 | 17,116.64 16.64,116.64 16,116 | 17,114 16,115 | 17,114 16,113 | 17,104.15 16,105.15 | 17,104.15 16.35,103.5 16,103.5 | 17,94.15 16,95.15 | 17,94.15 17,94 16,93 | 17,44 17,34.5 18.05,33.45 X12.1 25,33.45 | 17,44 17,54 18.65,55.65 X10.1 | J3.3 17.09,43.91 17,44 | J3.4 23.63,41.37 26,39 26,34.45 | 26,34.45 26,33 | 26,33 26,32.5 | 26,32.5 26,24.5 | 26,23.45 26,24.5 | 25,33.45 25.55,33.45 26,33 | 26,34.45 25,33.45 | 25,33.45 25.95,32.5 26,32.5 | 26,23.45 26,22.5 | 26,22.5 26,17.5 24,15.5 14,15.5 11,18.5 11,133 13.56,135.56 24,135.56 26.5,133.06 26.5,115 | 24.5,23.45 24.95,23.45 26,24.5 | 25.7,22.75 25,23.45 | DC/DC1.-IN 40.37,105.13 38.5,107 38.5,110.99 38.51,111 | 23,114.1 25.6,114.1 | 25.6,114.1 27,114.1 | 27,114.1 27.5,114.1 | 27.5,114.1 37.91,114.1 | 38.51,113.5 37.91,114.1 | 27,114.1 26.5,114.6 26.5,115 | 26.5,115 25.6,114.1 | 26.5,115 26.6,115 27.5,114.1 | 38.51,115 37.91,114.4 37.91,114.1 | 42.3,126.93 42.37,127 53.5,127 | 53.5,127 54.5,127 | 54.5,127 55.5,127 | 55.5,127 61,127 67.5,133.5 77,133.5 | 77,133.5 78,133.5 | 78,133.5 79,133.5 | 79,133.5 98.5,133.5 101.66,130.34 C1.2 101.66,112.84 103,111.5 133.5,111.5 137.3,115.3 S1.1 147.41,115.3 S2.1 149.36,115.27 149.59,115.04 151.47,115.04 151.7,115.27 154.5,115.27
  Bottom 0.7: 54.5,127 54.5,126 | 54.5,126 54.5,114.5 57.5,111.5 63.41,111.5 65.41,109.5 B1.GND@4 65.41,81.09 69,77.5 77,77.5 79.5,75 79.5,47.03 B1.GND@0 B1.GND@1 | 54.5,126 53.5,127 | 54.5,126 55.5,127 | D2.A 57.52,31.52 49.45,23.45 27,23.45 | 27,23.45 26,23.45 | 26,24.5 27,23.5 | 27,23.5 27,23.45 | 27,23.5 26,22.5 | 78,133.5 78,132.5 | 78,132.5 78,113.5 82.34,109.16 DC/DC1.-OUT | 78,132.5 77,133.5 | 78,132.5 79,133.5 | S2.2 156.75,115.27 | X14.2 153.5,139.5 155,141 163,141 | 163,141 164,141 | 164,141 165,141 | 165,141 166.5,141 169,138.5 169,127.5 170.5,126 173.5,126 175,124.5 v175,117.5 | X13.2 164,140 | 164,140 164,141 | 164,140 163,141 | 164,140 165,141 | S1.2 166.7,115.3 | 166.7,115.3 167.5,115.3 | 167.5,115.3 168.5,115.3 | 168.5,115.3 169.7,115.3 170.5,114.5 v170.5,113.5 170.25,113.25 | LED1.K 167.5,113.44 | 167.5,113.44 167.5,114.5 | 167.5,115.3 167.5,114.5 | 166.7,115.3 167.5,114.5 | 167.5,114.5 167.7,114.5 168.5,115.3 | 157.03,92 157.53,92 | 158,92 165.5,92 167.5,94 167.5,113.44 | 157.03,92.5 157.53,92 | 157.53,92 158,92 | 158,92 157.03,91.03 157.03,90.5 | 158,92 158,92.03 157.03,93 | X1.3 157.03,87.02 157.01,87 | X3.3 157.01,78.3 | 166.86,78.58 X4.3 156.98,70.05 156.93,70 157,69.93 157,67 153.78,63.78 153.1,63.78 | 166.86,78.58 167.56,78.58 DOTMATRIX.5 | DOTMATRIX.3 167.94,79.5 DOTMATRIX.5 | 167.94,71 DOTMATRIX.9 DOTMATRIX.7 167.94,77.5 | DOTMATRIX.11 DOTMATRIX.13 DOTMATRIX.15 | DOTMATRIX.5 167.94,77.5 | 166.86,78.58 167.94,77.5 | 153.1,63.78 148.93,63.78 148.33,63.17 148,62.84 148,58.5 | X8.1 148.9,52.6 148,53.5 148,57 | 148,57 148,57.5 | 148,57.5 148,58.5 | v149.07,57.52 149.06,57.5 148,57.5 | v149.07,57.52 148.98,57.52 148,58.5
  Bottom 0.7: v149.07,57.52 148.56,57 148,57 | B1.GND@3 B1.GND@2 126.71,51.98 X15.1 | B1.GND@3 | B1.GND@3 v141.33,51.99 | 123.15,22.45 123.15,21.7 | 123.15,21.7 123.15,21.05 | 123.15,21.05 123.2,21 | 123.2,21 123.85,21 | 123.85,21 134,21 135.2,22.2 135.2,24.6 OK3.2 | 113.5,21 122.7,21 | 122.7,21 123.1,21 | 123.1,21 123.15,21.05 | 123.2,21 123.1,21 | 123.15,21.7 122.7,21.25 122.7,21 | 123.15,21.7 123.85,21 | X7.2 152.99,63.67 153.1,63.78
  pour Bottom (isolate 1.016): 0,155 185,155 185,0 0,0
  pour Top (isolate 1.016): 0,155 185,155 185,0 0,0
GNDA
  Bottom 0.6: R6.1 77.22,21.21 77.22,16.12
  Bottom 0.61: R6.1 77.21,21.22 R5.1 77.22,16.12 R4.1
IN_LPWM  (via drill 1)
  Top 0.7: v57.17,24.23 57.17,70.96 | 57.14,71 57.17,70.96 | 57.17,70.96 57.17,74.33 54,77.5 54,89.86 57.2,93.06 57.2,96.7 61,100.5 83.25,100.5 v84.7,99.06
  Bottom 0.7: B1.7 84.7,95.17 v84.7,99.06 | v57.17,24.23 57.17,27.67 59,29.5 74.5,29.5 76.37,31.37 R2.1
IN_PWM  (via drill 1)
  Top 0.7: v72.16,40.8 77.2,40.8 78,40 78,38.93 v77.72,38.66 | v52.29,42.78 51.22,42.78 49.99,44.01 49.99,48.13 50.19,48.33 50.19,99.19 53.5,102.5 85.1,102.5 87.2,100.4 v87.2,99.03
  Bottom 0.7: v72.16,40.8 58.2,40.8 56,43 52.5,43 v52.29,42.78 | R1.1 77.21,37.71 77.72,38.22 v77.72,38.66 | v87.2,99.03 87.2,95.21 B1.6
IN_RPWM  (via drill 1)
  Top 0.305: 58.34,94.16 58.27,94.08
  Top 0.7: v80.68,99.01 80.33,98.66 62.84,98.66 58.34,94.16 58.34,83.16 65,76.5 65,46 60,41 60,23.26 62,21.26 62,21 73.1,21 75.6,23.5 75.6,24.64 v75.58,24.66
  Bottom 0.305: 80.65,95.5 B1.8
  Bottom 0.7: v80.68,99.01 80.68,95.54 80.65,95.5 | v75.58,24.66 75.58,26.08 76.65,27.15 R3.1
IR1
  Bottom 0.305: X1.2 154.49,98.59
  Bottom 0.7: B1.2 97.41,105.41 100,108 137.5,108 139,106.5 149.14,106.5 149.5,106.14 149.5,106.05 151.5,104.05 151.5,102 154.49,99.01 X1.2
IR2  (via drill 1)
  Top 0.35: v154.47,92.14 155.7,93.37 155.7,100.87 v155.79,100.96
  Bottom 0.305: 155.79,101.1 155.79,101 v155.79,100.96 | 154.47,87.5 X3.2
  Bottom 0.7: B1.3 94.87,107.87 97,110 135.5,110 138.5,113 158.5,113 161,110.5 161,103 159,101 155.79,101 | v154.47,92.14 154.47,87.5
IR3  (via drill 1)
  Top 0.305: 147.66,81.34 147.91,81.59
  Top 0.7: v144.72,101.42 144.72,82 145.38,81.34 147.66,81.34 | 147.91,81.59 149.3,82.98 154.01,82.98 v154.05,83.02
  Bottom 0.305: 154.26,82.77 154.05,82.98 v154.05,83.02
  Bottom 0.7: v144.72,101.42 144.72,104.28 144,105 119,105 117.5,103.5 117.5,95.39 B1.18 | X4.2 154.44,82.59 154.26,82.77
IR4  (via drill 1)
  Top 0.305: 152.5,66.46 v152.74,66.46
  Top 0.7: v120.26,101.09 121.09,101.92 141.98,101.92 142.86,101.04 142.86,69.24 145.64,66.46 152.5,66.46
  Bottom 0.305: 154.39,70 X5.2
  Bottom 0.7: B1.19 120.26,95.17 v120.26,101.09 | v152.74,66.46 152.79,66.5 154,66.5 154.39,66.89 154.39,70
KP_2
  Bottom 0.5: 163.31,43 163.31,42.81
  Bottom 0.6: B1.A8 112.65,45.35 119,39 159.5,39 163.31,42.81 | X6.1 163.31,43
KP_3
  Bottom 0.305: 160.77,43.42 160.77,45 X6.2
  Bottom 0.5: B1.A9 115.19,44.31 119.5,40 122,40 | 160.77,43 160.77,45
  Bottom 0.6: X6.2 160.77,43 160.77,42.77 158,40 122,40
KP_4
  Bottom 0.5: B1.A10 117.73,43.27 120,41 122,41
  Bottom 0.6: X6.3 158.23,42.73 156.5,41 122,41
KP_5
  Bottom 0.5: B1.A11 120.27,43.73 121.75,42.25
  Bottom 0.6: X6.4 155.69,43.19 154.5,42 122,42 121.75,42.25
KP_6
  Bottom 0.305: 122.8,46.89 B1.A12
  Bottom 0.5: 122.81,44.69 122.81,45
  Bottom 0.6: X6.5 153.15,44.15 152,43 124.5,43 122.81,44.69 | 122.81,45 B1.A12
KP_7
  Bottom 0.508: 150.61,46.89 X6.6 | 150,47.5 150.25,47.25
  Bottom 0.6: B1.A13 125.35,48.35 127.5,50.5 146,50.5 149,47.5 150,47.5 | 150.25,47.25 150.61,46.89
KP_8
  Bottom 0.305: 127.89,47.89 127.89,48.03
  Bottom 0.5: 137.98,48.48 136.7,49.77 134.32,49.77 133.49,48.93 133.42,48.93 | 138.23,48.23 137.98,48.48 | 137.98,48.48 137.99,48.48 138.47,48 139.5,48 | 148.07,45 148.07,44.07
  Bottom 0.508: 147,48 139.5,48 | 148.07,46.93 X6.7
  Bottom 0.6: 138.47,48 147,48 148.07,46.93 | X6.7 148.07,45 | B1.A14 127.89,47.89 128.93,48.93 133.42,48.93
KP_9
  Bottom 0.6: B1.A15 130.43,45.57 132.02,43.98 136.7,43.98 | 136.83,44.17 136.7,44.03 136.7,43.98 | X6.8 138,45.27 136.72,43.98 136.7,43.98
LED  (via drill 1)
  Top 0.305: 101.08,7.92 101.33,8.17 | 40.5,7.68 40,7.68 38.62,7.68 | 32.52,13.78 32.52,35.5 32.52,62 32.52,62.5 32.52,95.5 32.52,127.65 32.69,127.81
  Top 0.7: v64.1,125.74 64.1,128.4 61.74,130.76 35.64,130.76 32.69,127.81 32.69,95.67 | 32.69,95.67 32.52,95.5 | 32.69,95.67 32.69,62.17 32.52,62 | 32.52,62.5 32.52,35.5 32.5,35.47 32.5,12.5 37.32,7.68 40,7.68 | 40.5,7.68 100.84,7.68 101.08,7.92 | 101.33,8.17 103.1,9.94 v103.1,16.24
  Bottom 0.6: R11.2 v103.1,16.24
  Bottom 0.7: v64.1,125.74 64.1,113.9 67.95,110.05 B1.13
LPWM
  Bottom 0.5: 123.09,35 123.09,34.5
  Bottom 0.6: 153.5,27.38 151.62,27.38 149.5,29.5 149.5,33.5 147,36 124,36 123.09,35.09 123.09,35 OK2.3 | 159.97,27.97 161.1,26.83 161.1,20.99 | R5.2 89.02,17.78 122,17.78 | 129,17.78 157.89,17.78
  Bottom 0.61: 153.1,27.38 153.5,27.38 JP1.7 157.08,28.7 159.23,28.7 159.97,27.97 | 123.09,34.62 123.09,34.5 OK2.3 | 157.89,17.78 161.1,20.99 | 122,17.78 129,17.78
LS1  (via drill 1)
  Top 0.7: v75.5,126 v134.5,126
  Bottom 0.603: B1.11 73.03,96 | 73.03,104.5 73.03,123.53
  Bottom 0.7: v75.5,126 74,126 73.03,125.03 73.03,104.5 B1.11 | v134.5,126 145.5,126 149.5,122 163,122 165.5,124.5 165.5,129 | 165.5,129 165.5,129.5 | 165.5,129.5 165.5,130.5 | 165.5,130.5 165.5,132.5 163.5,134.5 160.5,134.5 159,136 X13.1 | R14.1 164.5,129.5 | 164.5,129.5 165.5,129.5 | 165.5,130.5 164.5,129.5 | 164.5,129.5 165,129 165.5,129
LS2  (via drill 1)
  Top 0.603: 73,128.5 v72.5,128.5
  Top 0.7: v148,132.5 143.5,132.5 139.5,128.5 73,128.5
  Bottom 0.603: 148,137.23 X14.1
  Bottom 0.7: v72.5,128.5 71.5,128.5 70.49,127.49 B1.12 | R15.1 159.5,124.5 151.5,132.5 149.5,132.5 | 149.5,132.5 148.5,132.5 | 148.5,132.5 v148,132.5 147.5,132.5 148.5,133.5 | X14.1 148.5,133.5 | 148.5,133.5 148.5,132.5 | 148.5,133.5 149.5,132.5
N$1  (via drill 1)
  Top 0.305: 132.8,118.22 133.01,118.01 | 59.87,118.22 52.57,110.93 | 41.59,12.32 42,12.32 | 88.2,14.53 v88.2,14.58
  Top 0.7: v161.91,113.12 137.91,113.12 133.01,118.01 132.99,118.01 132.5,118.5 60.15,118.5 52.57,110.93 44.54,102.89 44.54,38.94 44.55,38.92 38.06,32.44 38.06,15.84 41.59,12.32 | 88.2,14.53 77.71,14.53 75.5,12.32 42,12.32
  Bottom 0.305: R11.1 90.53,16.08
  Bottom 0.6: v88.2,14.58 89.86,16.23 R11.1
  Bottom 0.7: v161.91,113.12 162.05,113.25 LED1.A
N$5
  Bottom 0.61: 20.17,121.64 J1.1 | 19.45,132.22 X2.2
  Bottom 0.7: J1.2 22.18,119.18 23.5,120.5 | 23.5,120.5 24,121 24,122 | 24,122 24,122.5 | 24,122.5 24,130.5 22.28,132.22 X2.2 17.22,132.22 14,129 14,77.5 17.5,74 37.5,74 41.5,70 41.5,44.5 49.74,36.26 D1.A | J1.1 23,121.72 | 23.22,121.72 23.72,121.72 24,122 | 23,121.72 23.22,121.72 | 23.22,121.72 24,122.5 | 23,121.72 23.5,121.22 23.5,120.5
N$8
  Bottom 0.6: R1.2 87.37,38.37 88.5,39.5 103,39.5 104.57,37.93 104.57,27.5 108.07,24 OK1.1
N$12
  Bottom 0.6: OK2.1 120.55,25.45 119.41,26.59 108.5,26.59 106.01,29.08 106.01,38.99 104,41 86.5,41 85.18,39.68 85.18,32.32 86.13,31.37 R2.2
N$24
  Bottom 0.6: R3.2 84.35,27.15 83.5,28 83.5,30.98 | 83.5,30.98 83.55,31.03 | 83.5,30.98 83.5,40.5 85.5,42.5 105.5,42.5 107.62,40.38 107.62,30 109.8,27.82 128.32,27.82 | 128.57,27.57 130.55,25.59 | 130.55,25.5 OK3.1
  Bottom 0.61: 130.55,25.59 130.55,25.5 | 128.32,27.82 128.57,27.57
OE  (via drill 0.9 pad 1.35, 1)
  Top 0.303: 149.5,80.4 148.65,80.4 v148.04,79.8
  Top 0.305: 161.39,81.11 161.64,81.36 | 149.35,80.4 149.5,80.4
  Top 0.7: v148.04,79.8 149.35,81.11 161.39,81.11 | 161.64,81.36 v163.56,83.28
  Bottom 0.305: v148.04,79.8 148.04,79.31
  Bottom 0.7: v163.56,83.28 DOTMATRIX.1 | B1.49 141.1,59.6 143,61.5 143,65.5 148.04,70.54 v148.04,79.8
PWM
  Bottom 0.5: 151.5,31.5 151.75,31.25 | 153.08,29.92 154,29.92
  Bottom 0.6: 112.09,34.68 112.09,36.09 113,37 150,37 151.5,35.5 151.5,31.5 | 151.75,31.25 153.08,29.92 JP1.5 JP1.6 161.22,29.92 164.78,26.36 164.78,19.55 159.58,14.35 94,14.35 92.65,13 88.5,13 87.38,11.88 R4.2 87.49,11.5
  Bottom 0.61: JP1.5 154,29.92 153.3,29.92 | OK1.3 112.09,34.68
RESET  (via drill 1)
  Top 0.305: 111.82,103.41 111.45,103.04 110.95,102.54 109.95,101.54 105.95,97.55 | 87,44.4 87,48.6 99.2,60.81 99.2,61 99.2,81.57 99.31,81.69 | 85.61,43.01 74,43.01 v73.3,43.01
  Top 0.7: v140.59,107.94 133.44,107.94 131.75,106.25 131,105.5 113.91,105.5 | 113.91,105.5 113.5,105.5 111.45,103.46 | 111.45,103.04 111.45,103.46 | 110.95,102.96 106,98 105.5,98 | 105.95,97.55 105.95,88.33 99.31,81.69 99.31,61.11 | 110.95,102.54 110.95,102.96 | 110.95,102.96 111.45,103.46 | 109.95,101.54 113.91,105.5 | 99.31,61.11 99.2,61 | 99.31,61.11 99.31,60.92 87,48.6 87,48.59 87,43.5 86.51,43.01 74,43.01
  Bottom 0.7: v73.3,43.01 73.3,44.21 72.01,45.5 B1.RESET | v140.59,107.94 140.59,109.59 141.5,110.5 144.1,110.5 S1.3 147.01,110.32 S2.3 S2.4 156.35,110.75 S1.4
RPWM
  Bottom 0.6: JP1.8 158.3,21.3 156.76,19.76 154.5,19.76 | 121.5,19.76 105.08,19.76 100.91,23.92 88.42,23.92 87.34,22.84 R6.2 | OK3.3 140.78,32.22 143,30 143,20.76 | 143,20.76 143,20.5 | 143,20.5 143,19.76 | 143,20.76 144,19.76 | 143,20.5 142.26,19.76 142,19.76
  Bottom 0.61: 133.09,33.95 OK3.3 | R6.2 87.78,21.24 | 121.5,19.76 142,19.76 143,19.76 144,19.76 154.5,19.76 155.33,19.76
SCK  (via drill 0.9 pad 1.35, 1)
  Top 0.305: 145.48,73.02 v145.47,73.01
  Top 0.7: v174.53,73.11 173.21,74.43 149,74.43 147.57,73 145.5,73 145.48,73.02
  Bottom 0.305: 139,60.89 133.51,60.89 132.97,60.35 B1.48
  Bottom 0.61: 174.59,73.12 174.6,73.11 v174.53,73.11
  Bottom 0.7: DOTMATRIX.10 174.59,73.12 | 139,60.89 141.5,63.39 141.5,70.5 144.01,73.01 v145.47,73.01
SCL  (via drill 1)
  Top 0.305: 149.95,58.45 150.18,58.23 | 139.78,44.72 139.93,44.87 139.93,57.48 139.9,57.5 139.9,57.69
  Top 0.7: v95.52,38.19 133.25,38.19 139.78,44.72 | 139.93,44.87 140,44.94 140,60.4 | 140,60.4 140,61 | 140,61 140,62 | 140,62 140,88.5 140.68,89.18 v140.68,100.5 | 140.85,61.25 140.25,61.25 140,61 | 141,61.25 147.16,61.25 149.95,58.45 | 150.18,58.23 v154.46,58.23 | 141,61.25 140.25,62 140,62 | 141,61.25 140.85,61.25 | 140.85,61.25 140,60.4
  Bottom 0.305: 155.53,61 X7.3 | 87.01,25.69 88.25,25.69 88.9,26.34 88.9,27 | 92.55,38.17 95.52,38.17 v95.52,38.19
  Bottom 0.6: v95.52,38.19 91.19,38.19 90.27,37.27 R7.1 90.27,34.37 88.9,33 88.9,27 | 87.01,25.69 84.69,25.69 83.5,24.5 83.5,20 84.7,18.8 89.8,18.8 90.27,19.27 R10.1
  Bottom 0.61: X8.4 158.07,55.98 160.08,58 160.08,62 160.08,62.7 | 155.36,61.66 X7.3
  Bottom 0.7: B1.21 125.35,99.35 126.5,100.5 v140.68,100.5 | v154.46,58.23 155.53,59.3 155.53,61 | X7.3 155.53,63.03 156.5,64 159.5,64 160.08,63.42 160.08,62
SDA  (via drill 1)
  Top 0.305: v159.21,49.38 160.48,49.38 | 177.98,66.88 177.98,67 | 103.49,31.12 103.49,31 103.49,30.5 | 172.86,23 172.86,43.47
  Top 0.7: v95.66,33.35 101.27,33.35 101.31,33.31 | 101.31,33.31 101.31,33.18 103.49,31 | 101.31,33.31 103.49,31.12 103.49,30.5 103.49,24.34 103.46,24.3 103.46,20.43 104.43,19.45 169.31,19.45 172.86,23 172.86,48.02 | 172.86,48.02 172.86,49 | 172.86,49 172.86,49.5 | 172.86,49.5 172.86,50.5 | v159.21,49.38 171.5,49.38 | 171.5,49.38 172,49.38 | 172.86,49.5 172.74,49.38 172.49,49.38 | 172,49.38 172,49.64 172.86,50.5 | 172.86,49 172.49,49.38 | 172.49,49.38 172,49.38 | 171.5,49.38 172.86,48.02 | 172.86,50.5 172.86,61.88 177.98,67 177.98,96.61 171.04,103.54 141.04,103.54 v141,103.5
  Bottom 0.305: R9.1 R8.1 92.31,33.35 v95.66,33.35
  Bottom 0.61: 155.53,53 X8.3
  Bottom 0.7: B1.20 122.81,101.31 125,103.5 v141,103.5 | X7.4 158.07,58.94 155.53,56.4 155.53,53 | v159.21,49.38 156.84,49.38 155.53,50.69 X8.3
TRIG1
  Bottom 0.7: X15.3 118.23,63.27 113.5,68 113.5,88.5 110,92 110,95.05 B1.15
TRIG2
  Bottom 0.7: 119.23,77.77 X16.3 119.73,77.77 117.5,80 117.5,91 115.19,93.31 B1.17
VD1  (via drill 1)
  Top 0.305: 46.83,102.31 47.01,102.49 | 46.85,37.67 46.85,38
  Top 0.7: v122.03,113.93 122,113.96 122,115 120.5,116.5 109,116.5 108.58,116.5 61.02,116.5 60.76,116.24 47.01,102.49 | v41.11,15.35 39.38,17.08 39.38,30.2 46.85,37.67 | 46.85,38 46.85,102.28 46.83,102.31
  Bottom 0.61: R13.2 101.92,8.35 92,8.35 90.5,8.35 89.5,8.35 46.65,8.35 43.42,11.58 | IC1.IN 43.42,15.31
  Bottom 0.7: 43.42,11.58 IC1.IN 41.19,15.43 v41.11,15.35 | v122.03,113.93 123.93,113.93 124.5,114.5 126.46,114.5 C2.1 | R12.1 90.68,9.5 | 90.68,9.5 90.68,8.53 90.5,8.35 | 89.5,8.35 90.65,9.5 90.68,9.5 | 90.68,9.5 90.85,9.5 92,8.35
VDD  (via drill 1)
  Top 0.61: v169.91,34.68 163.49,34.68 v163.49,34.71
  Top 0.7: v105.94,103.01 105.5,103.45 105.5,113.5 106,114 107.03,114 v107.12,113.9
  Bottom 0.305: 105.86,103.1 v105.94,103.01
  Bottom 0.5: 161.5,36.5 161.5,36 161.5,35.5 | 161.5,34.71 161.5,35.5 | 160.5,34.71 160.71,34.71 161.5,35.5 | 161.5,35.5 161.75,35.25 162,35 162,34.71
  Bottom 0.6: 110.5,38.05 110.5,38 110.5,37.95 | 113,38 160,38 161.5,36.5 | 161.5,36 161.5,34.71 | 161.75,35.25 162.29,34.71 163,34.71 | 119.46,29.54 120,29.54 | 120,29.54 120.5,29.54 | 120.5,29.54 121.64,29.54 121.69,29.49 | OK2.4 120.55,29.59 120.5,29.54 | 120.21,30.29 120.21,29.75 120,29.54 | OK1.4 109.55,30.41 | 110.68,29.28 122.37,29.28 122.5,29.41 124,29.41 | 124,29.41 128.37,29.41 | OK3.4 130.55,31.59 | 122.1,29.49 123.92,29.49 124,29.41
  Bottom 0.61: OK2.4 120.55,30.63 | 109.55,30.41 110.68,29.28 119.2,29.28 119.46,29.54 120.21,30.29 120.55,30.63 | 120.55,30.63 121.69,29.49 | 121.69,29.49 122.1,29.49 | 130.55,31.59 128.37,29.41 | 122.5,29.41 121.77,29.41 121.69,29.49 | IC1.OUT 48.36,15.57 48.36,19.61 | 36.41,18.51 36.41,8.04 40.79,3.66 107.5,3.66 | v163.49,34.71 163,34.71 162,34.71 161.5,34.71 160.5,34.71 158.59,34.71 JP1.2
  Bottom 0.7: D4.C 62.58,22.08 61.75,21.25 49.25,21.25 | 36.41,18.51 36.41,18.91 38.75,21.25 47.75,21.25 | 47.75,21.25 48.5,21.25 | 48.5,21.25 49.25,21.25 | 48.5,21.25 48.5,20.5 | 48.5,20.5 48.5,15.71 48.36,15.57 | 48.5,20.5 47.75,21.25 | 48.5,20.5 49.25,21.25 | v107.12,113.9 108.9,113.9 109.25,114.25 C3.1 | 109.5,38 109.5,38.5 | 109.5,38.5 109.5,82.45 105,86.95 105,97 105.94,97.94 v105.94,103.01 | v169.91,34.68 170.12,34.48 170.12,16.33 161.79,8 111.84,8 107.5,3.66 | 113,38 110.5,38 110,38 | 110,38 109.5,38 | OK1.4 109.5,31.67 109.5,37.5 | 109.5,37.5 109.5,38 | 109.5,37.5 110,38 | 110,38 109.5,38.5
(copper drawn outside any net)
  shapes: Bottom area x7943, Top area x2